# EasyEDA Pro project ProProject_2024电赛备赛清单_Wang01_2024-08-05.epro, schematic Schematic3
Create Date: 2024-07-20; Page Name: P1; Project Name: 2024电赛备赛清单_Wang01; Schematic Name: Schematic3; Update Date: 2024-07-20; Company: 嘉立创EDA; Page Size: A4; Version: V1.0
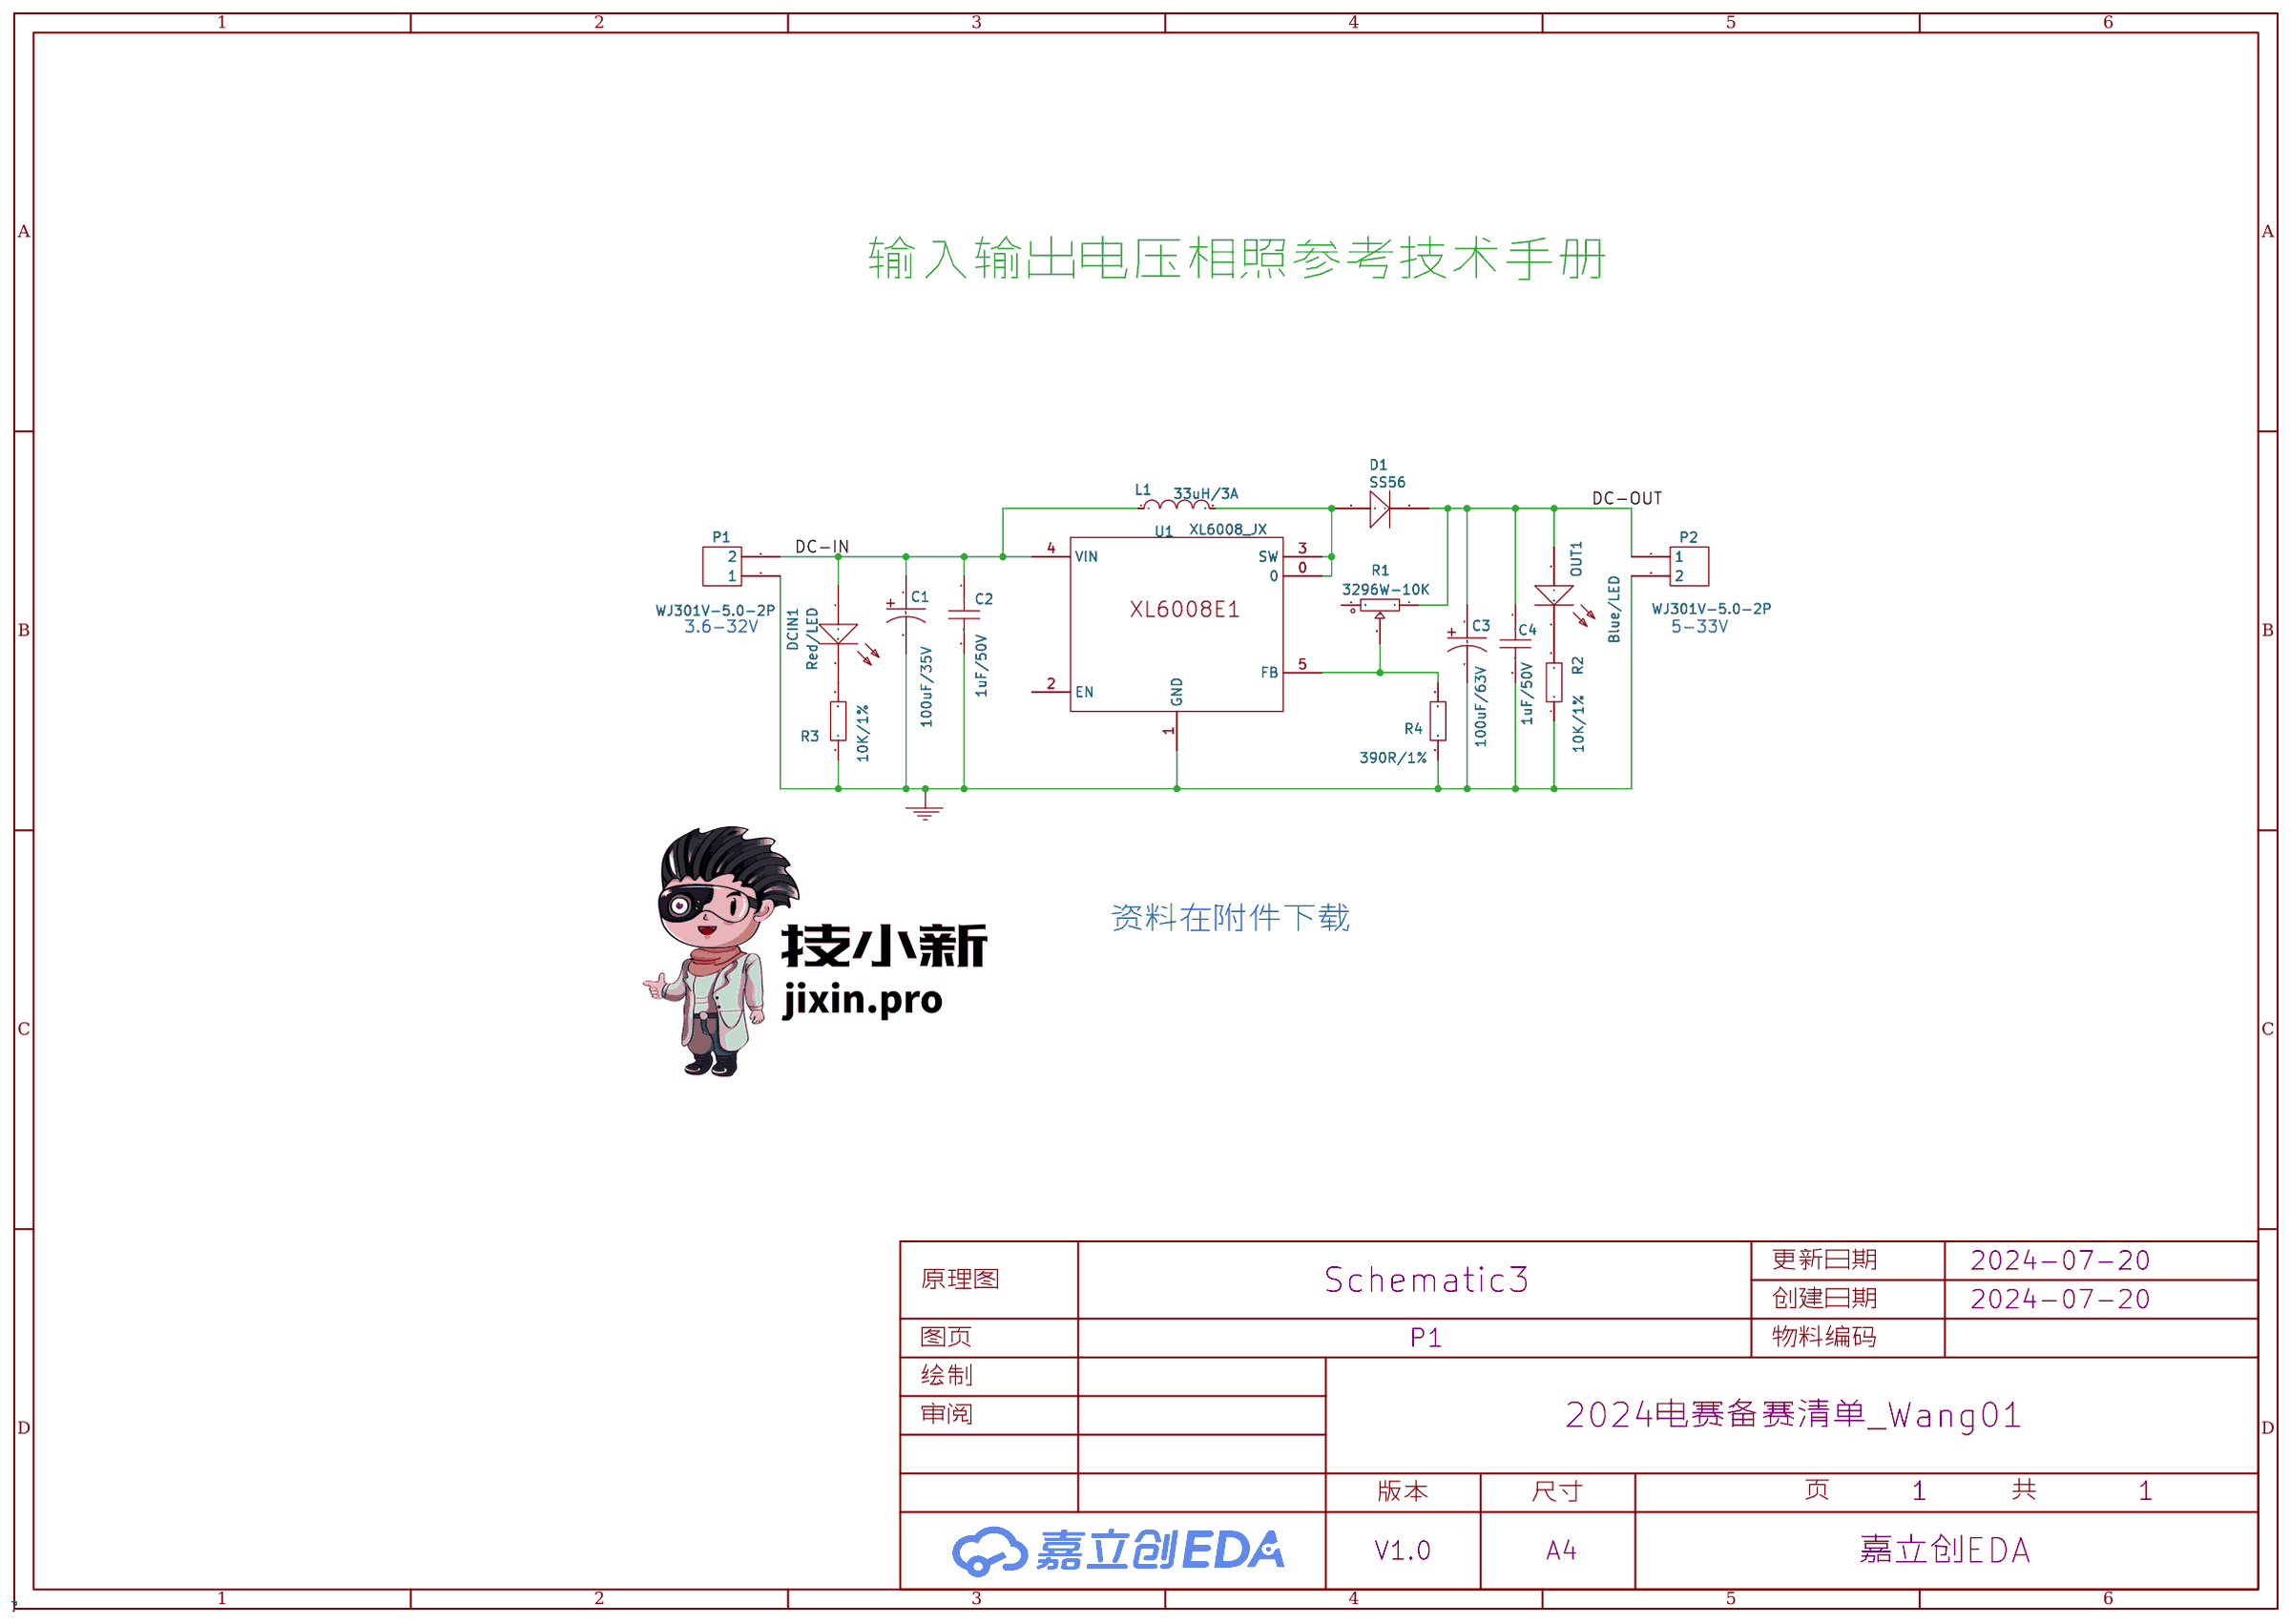
[diagram p5: schematic sheet]

## Parts
C1  100uF/35V  [6.3X7.7_JX]
C2  1uF/50V  [0603_C_JX]
C3  100uF/63V  [10_JX]
C4  1uF/50V  [0603_C_JX]
D1  SS56  [DO214AC_JX]
DCIN1  Red/LED  [0603_D_JX]
L1  33uH/3A
OUT1  Blue/LED  [0603_D_JX]
P1  WJ301V-5.0-2P  [5.0-1*2P_JX]
P2  WJ301V-5.0-2P  [5.0-1*2P_JX]
R1  3296W-10K  [RES-ADJ_JX]
R2  10K/1%  [0603_R_JX]
R3  10K/1%  [0603_R_JX]
R4  390R/1%  [0603_R_JX]
U1  XL6008_JX  [TO252-5_JX]

## Library data of the parts
C1 = 100uF/35V: Supplier: LCSC
C2 C4 = 1uF/50V: Supplier: LCSC
C3 = 100uF/63V: Supplier: LCSC
D1 = SS56: Supplier: LCSC
DCIN1 = Red/LED: Supplier: LCSC
L1 = 33uH/3A: Supplier: LCSC
OUT1 = Blue/LED: Supplier: LCSC
P1 P2 = WJ301V-5.0-2P: Supplier: LCSC
R1 = 3296W-10K: K(%): 50; Supplier: LCSC
R2 R3 = 10K/1%: Supplier: LCSC
R4 = 390R/1%: Supplier: LCSC
U1 = XL6008_JX: Supplier: LCSC

## Nets
GND: C1.2 C2.2 C3.2 C4.2 P1.1 P2.2 R2.1 R3.1 R4.1 U1.1(GND)
DC-IN: C1.1 C2.1 DCIN1.1(A) L1.1 P1.2 U1.4(VIN)
DC-OUT: C3.1 C4.1 D1.2(K) OUT1.1(A) P2.1 R1.1
Net-(D1-1): D1.1(A) L1.2 U1.0 U1.3(SW)
Net-(DCIN1-2): DCIN1.2(C) R3.2
Net-(OUT1-2): OUT1.2(C) R2.2
R1_2: R1.2(3) R4.2 U1.5(FB)

Not connected (* = marked no-connect by the designer): R1 3(2); U1 2(EN)

## Notes on the sheet
- 输入输出电压相照参考技术手册
- 3.6-32V
- 5-33V
- 资料在附件下载
